# Altium schematic sheet USB.SchDoc
size A; SheetNumber: 6; SheetTotal: 12
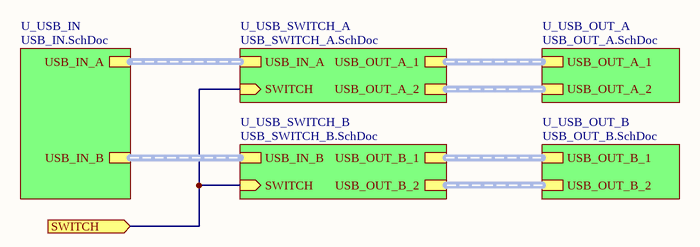
[diagram p0: USB.SchDoc]

## Sub-sheets
U_USB_IN = USB_IN.SchDoc: USB_IN_A (harness USB_IN_A), USB_IN_B (harness USB_IN_B)
U_USB_OUT_A = USB_OUT_A.SchDoc: USB_OUT_A_1 (harness USB_OUT_A_1), USB_OUT_A_2 (harness USB_OUT_A_2)
U_USB_OUT_B = USB_OUT_B.SchDoc: USB_OUT_B_1 (harness USB_OUT_B_1), USB_OUT_B_2 (harness USB_OUT_B_2)
U_USB_SWITCH_A = USB_SWITCH_A.SchDoc: USB_OUT_A_1 (harness USB_OUT_A_1), USB_IN_A (harness USB_IN_A), USB_OUT_A_2 (harness USB_OUT_A_2), SWITCH (in)
U_USB_SWITCH_B = USB_SWITCH_B.SchDoc: USB_OUT_B_1 (harness USB_OUT_B_1), USB_IN_B (harness USB_IN_B), USB_OUT_B_2 (harness USB_OUT_B_2), SWITCH (in)

## Ports
SWITCH (in, see TOP[2B], HDMI[2B], HDMI_SWITCH[1C], USB_SWITCH_A[1B], USB_SWITCH_B[1B])

## Nets
SWITCH: port SWITCH, sheet U_USB_SWITCH_A/SWITCH, sheet U_USB_SWITCH_B/SWITCH

## Buses and harness runs
harness sheet U_USB_IN/USB_IN_A = sheet U_USB_SWITCH_A/USB_IN_A
harness sheet U_USB_IN/USB_IN_B = sheet U_USB_SWITCH_B/USB_IN_B
harness sheet U_USB_OUT_A/USB_OUT_A_1 = sheet U_USB_SWITCH_A/USB_OUT_A_1
harness sheet U_USB_OUT_A/USB_OUT_A_2 = sheet U_USB_SWITCH_A/USB_OUT_A_2
harness sheet U_USB_OUT_B/USB_OUT_B_1 = sheet U_USB_SWITCH_B/USB_OUT_B_1
harness sheet U_USB_OUT_B/USB_OUT_B_2 = sheet U_USB_SWITCH_B/USB_OUT_B_2